# EAGLE schematic right-angle-extender (EAGLE 7.7.0)
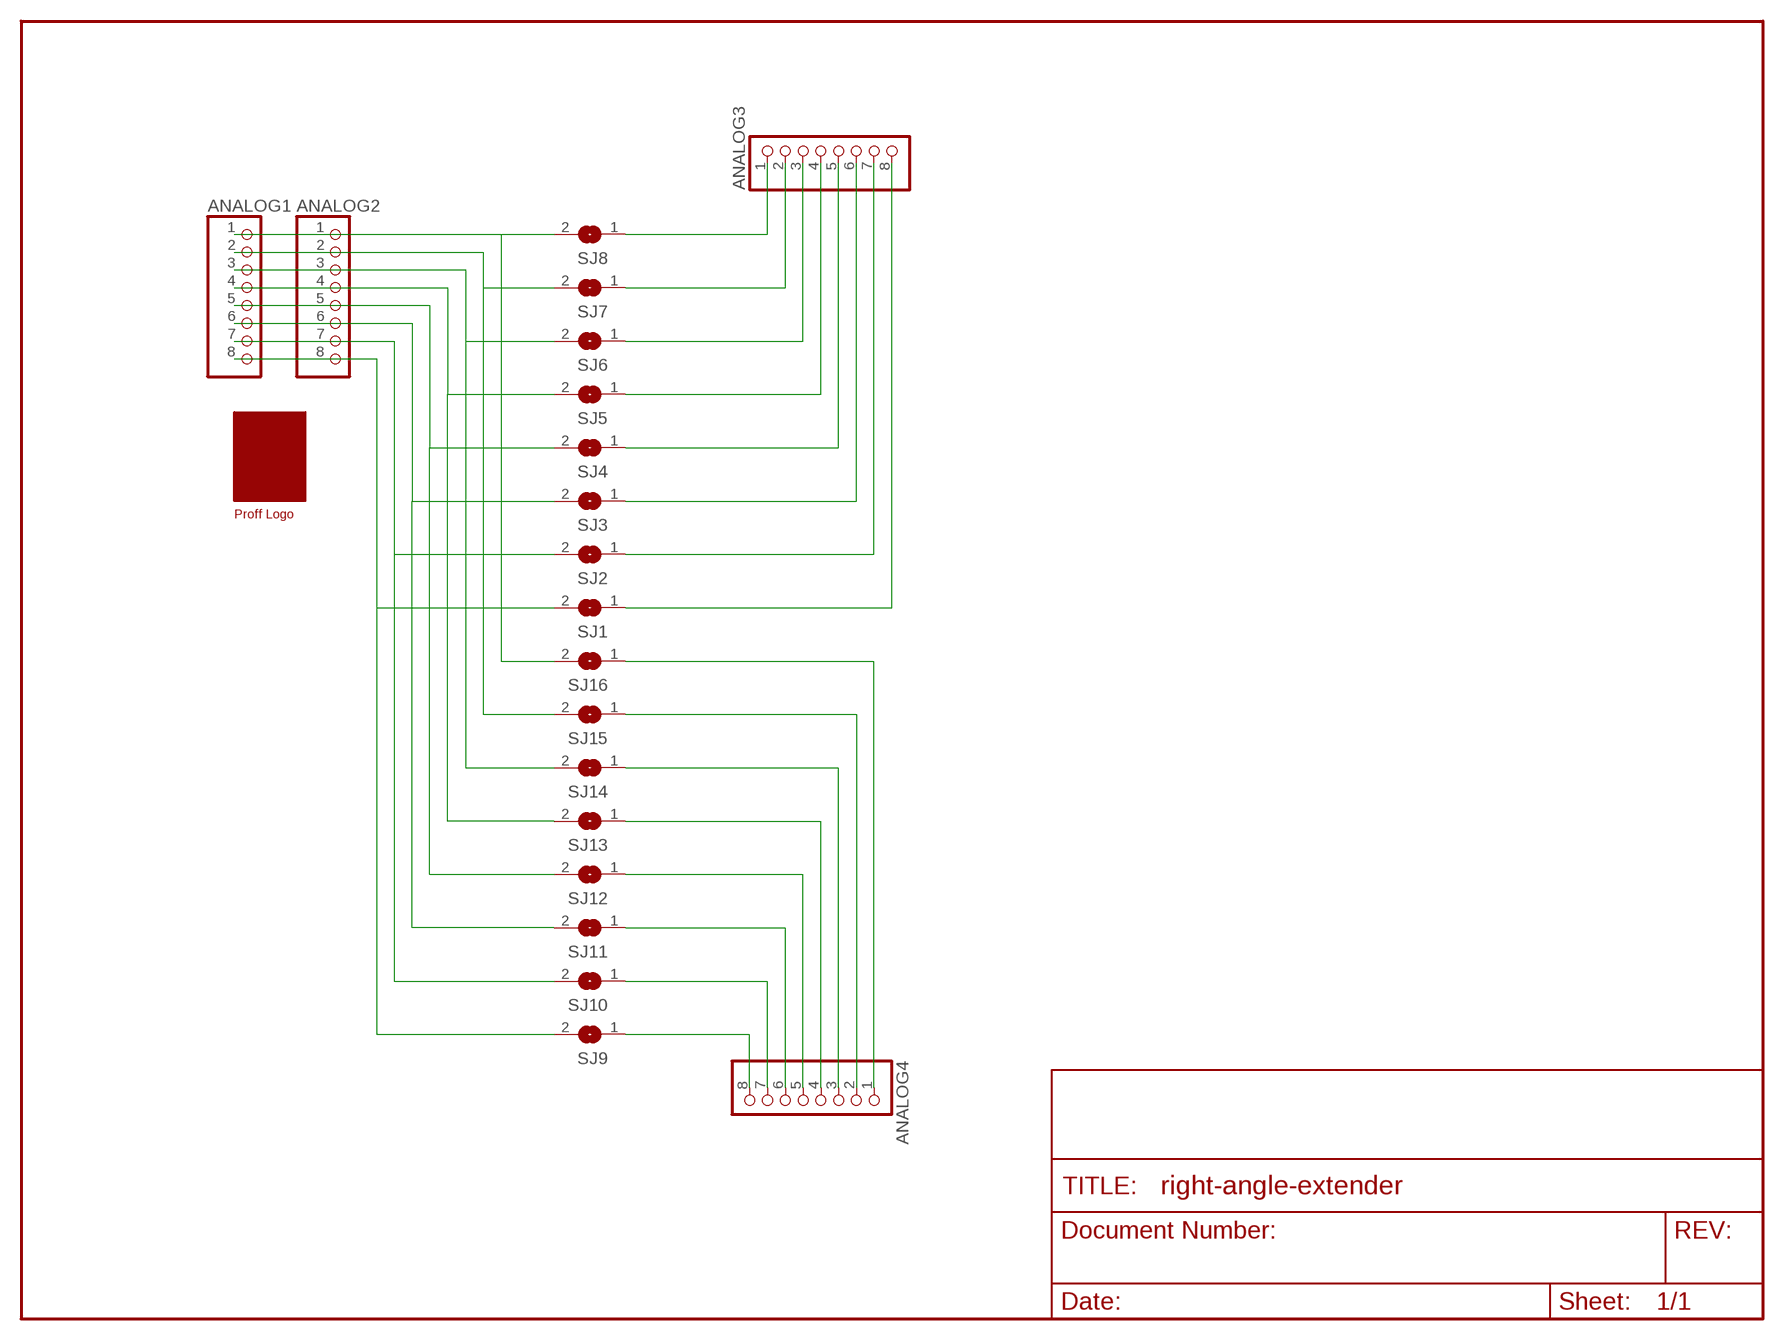
[diagram p0: schematic, sheet 1]

## Parts
ANALOG1  PINHD-1X8  [1X08]
ANALOG2  PINHD-1X8  [1X08]
ANALOG3  PINHD-1X8  [1X08]
ANALOG4  PINHD-1X8  [1X08]
SJ1  SJ  [SJ]
SJ2  SJ  [SJ]
SJ3  SJ  [SJ]
SJ4  SJ  [SJ]
SJ5  SJ  [SJ]
SJ6  SJ  [SJ]
SJ7  SJ  [SJ]
SJ8  SJ  [SJ]
SJ9  SJ  [SJ]
SJ10  SJ  [SJ]
SJ11  SJ  [SJ]
SJ12  SJ  [SJ]
SJ13  SJ  [SJ]
SJ14  SJ  [SJ]
SJ15  SJ  [SJ]
SJ16  SJ  [SJ]
U$1  PROFF  [PROFF]

## Nets
N$1: ANALOG1.1 ANALOG2.1 SJ8.2 SJ16.2
N$2: ANALOG1.2 ANALOG2.2 SJ7.2 SJ15.2
N$3: ANALOG1.3 ANALOG2.3 SJ6.2 SJ14.2
N$7: ANALOG1.7 ANALOG2.7 SJ2.2 SJ10.2
N$8: ANALOG1.8 ANALOG2.8 SJ1.2 SJ9.2
N$9: ANALOG3.5 SJ4.1
N$10: ANALOG3.6 SJ3.1
N$11: ANALOG3.7 SJ2.1
N$12: ANALOG3.8 SJ1.1
N$13: ANALOG3.4 SJ5.1
N$14: ANALOG3.3 SJ6.1
N$15: ANALOG3.2 SJ7.1
N$16: ANALOG3.1 SJ8.1
N$20: ANALOG1.4 ANALOG2.4 SJ5.2 SJ13.2
N$21: ANALOG1.5 ANALOG2.5 SJ4.2 SJ12.2
N$22: ANALOG1.6 ANALOG2.6 SJ3.2 SJ11.2
N$25: ANALOG4.5 SJ12.1
N$26: ANALOG4.6 SJ11.1
N$27: ANALOG4.7 SJ10.1
N$28: ANALOG4.8 SJ9.1
N$29: ANALOG4.4 SJ13.1
N$30: ANALOG4.3 SJ14.1
N$31: ANALOG4.2 SJ15.1
N$32: ANALOG4.1 SJ16.1

## Library data of the parts
ANALOG1-ANALOG4 = pinhead:PINHD-1X8: PIN HEADER
SJ1-SJ16 = jumper:SJ: SMD solder JUMPER
U$1 = logo:PROFF